# EAGLE design Microduino-Core BLE 20140627 (EAGLE 6.3)
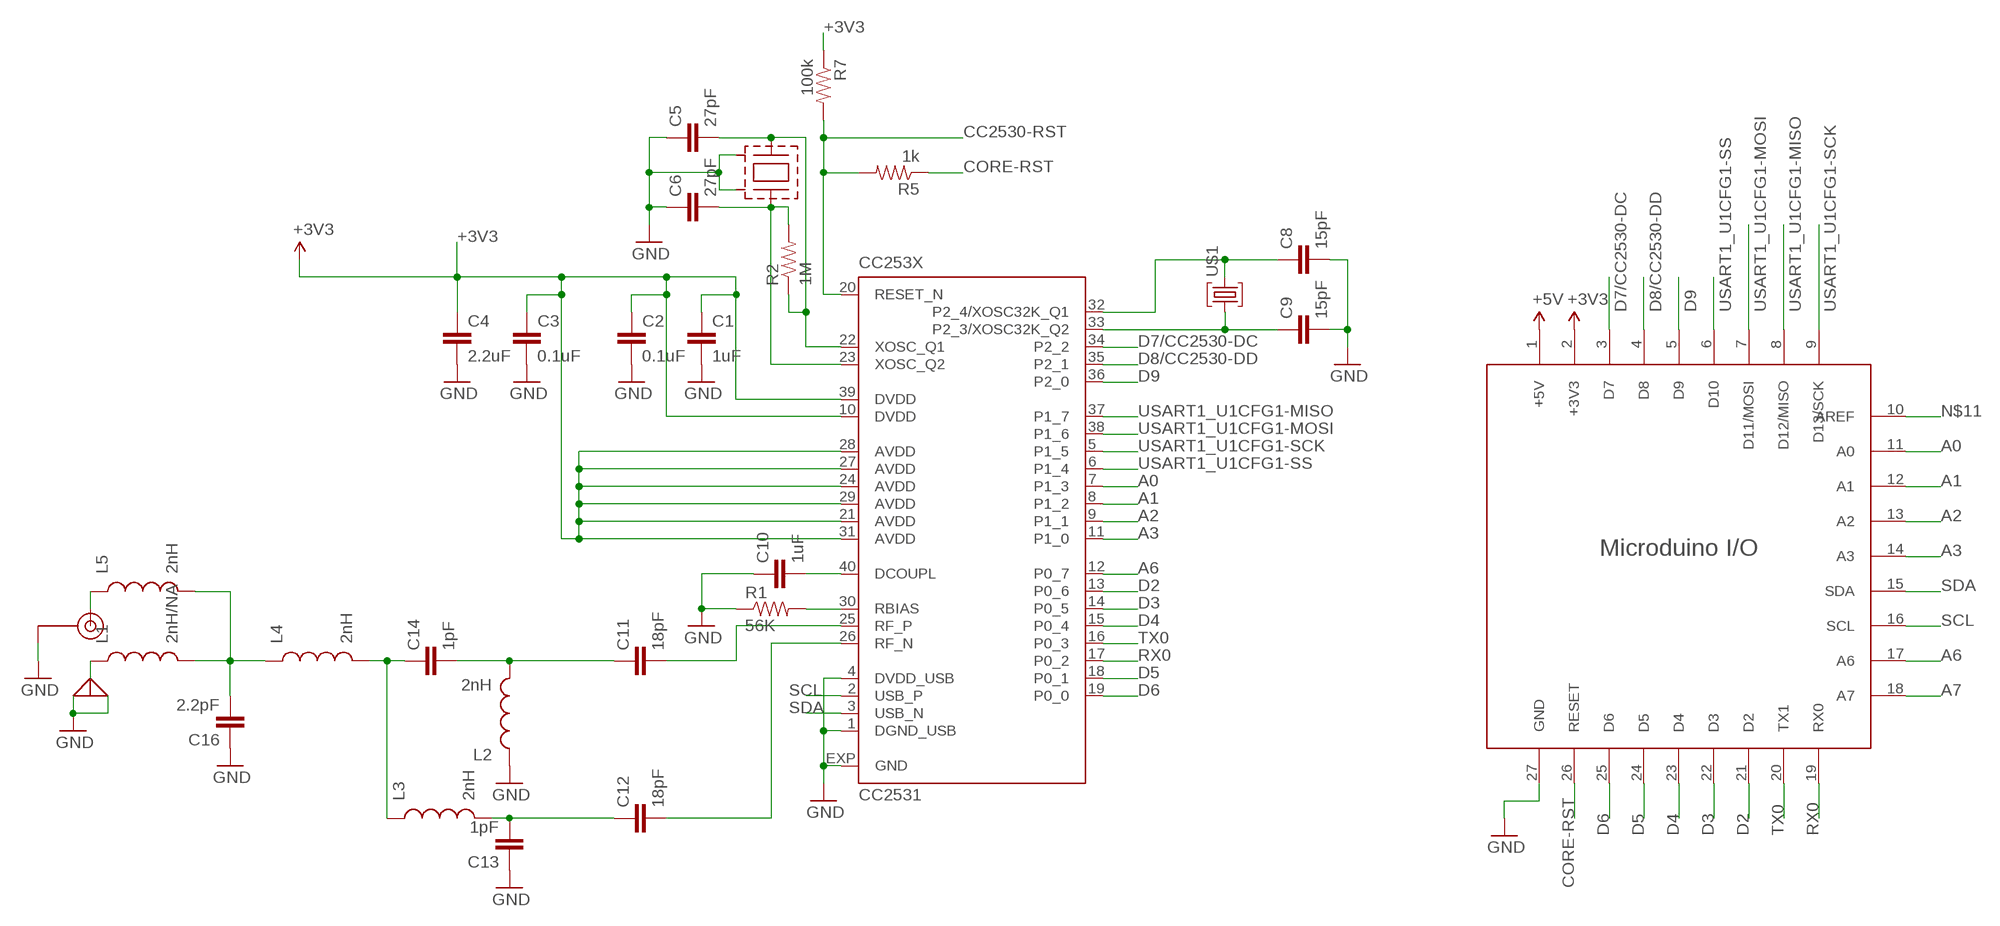
[diagram p0: schematic, sheet 1]

## Parts
C1  1uF  CAP0603-CAP  [0603-CAP]
C2  0.1uF  CAP0402-CAP  [0402-CAP]
C3  0.1uF  CAP0402-CAP  [0402-CAP]
C4  2.2uF  CAP0402-CAP  [0402-CAP]
C5  27pF  CAP0402-CAP  [0402-CAP]
C6  27pF  CAP0402-CAP  [0402-CAP]
C8  15pF  CAP0402-CAP  [0402-CAP]
C9  15pF  CAP0402-CAP  [0402-CAP]
C10  1uF  CAP0603-CAP  [0603-CAP]
C11  18pF  CAP0402-CAP  [0402-CAP]
C12  18pF  CAP0402-CAP  [0402-CAP]
C13  1pF  CAP0402-CAP  [0402-CAP]
C14  1pF  CAP0402-CAP  [0402-CAP]
C16  2.2pF  CAP0402-CAP  [0402-CAP]
CC253X  CC2531  [RHA_S-PVQFN-N40]
CRYS.1  CRYSTAL-SMD  [CRYSTAL-SMD-3225]
L1  2nH/NA  INDUCTOR0402  [C0402]
L2  2nH  INDUCTOR0402  [C0402]
L3  2nH  INDUCTOR0402  [C0402]
L4  2nH  INDUCTOR0402  [C0402]
L5  2nH  INDUCTOR0402  [C0402]
R1  56K  RESISTOR0402-RES  [0402-RES]
R2  1M  RESISTOR0402-RES  [0402-RES]
R5  1k  RESISTOR0402-RES  [0402-RES]
R7  100k  RESISTOR0402-RES  [0402-RES]
U$1  32.768-3215  [3215-2PIN]
U$2  ANT2.4G  [ANT2.4G]
U$3  ANT-IPEX  [IPEX]
U$7  MICRDUINO-PIN/NORMAL  [27UPIN-NORMAL]

## Nets
+3V3: C1.1 C2.1 C3.1 C4.1 CC253X.10(DVDD) CC253X.21(AVDD) CC253X.24(AVDD) CC253X.27(AVDD) CC253X.28(AVDD) CC253X.29(AVDD) CC253X.31(AVDD) CC253X.39(DVDD) R7.1 U$7.2(+3V3)
+5V: U$7.1(+5V)
A0: CC253X.7(P1_3) U$7.11(A0)
A1: CC253X.8(P1_2) U$7.12(A1)
A2: CC253X.9(P1_1) U$7.13(A2)
A3: CC253X.11(P1_0) U$7.14(A3)
A6: CC253X.12(P0_7) U$7.17(A6)
A7: U$7.18(A7)
CC2530-RST: CC253X.20(RESET_N) R5.2 R7.2
CORE-RST: R5.1 U$7.26(RESET)
D2: CC253X.13(P0_6) U$7.21(D2)
D3: CC253X.14(P0_5) U$7.22(D3)
D4: CC253X.15(P0_4) U$7.23(D4)
D5: CC253X.18(P0_1) U$7.24(D5)
D6: CC253X.19(P0_0) U$7.25(D6)
D7/CC2530-DC: CC253X.34(P2_2) U$7.3(D7)
D8/CC2530-DD: CC253X.35(P2_1) U$7.4(D8)
D9: CC253X.36(P2_0) U$7.5(D9)
GND: C1.2 C2.2 C3.2 C4.2 C5.1 C6.1 C8.2 C9.2 C10.1 C13.1 C16.1 CC253X.1(DGND_USB) CC253X.4(DVDD_USB) CC253X.EXP(GND) CRYS.1.2 CRYS.1.4 L2.1 R1.1 U$2.GND(GND2) U$3.1(GND1) U$3.2(GND2) U$7.27(GND)
N$1: C16.2 L1.2 L4.1 L5.2
N$2: C10.2 CC253X.40(DCOUPL)
N$3: C5.2 CC253X.22(XOSC_Q1) CRYS.1.1 R2.1
N$4: C6.2 CC253X.23(XOSC_Q2) CRYS.1.3 R2.2
N$5: CC253X.30(RBIAS) R1.2
N$6: C11.2 CC253X.25(RF_P)
N$7: C12.2 CC253X.26(RF_N)
N$8: C11.1 C14.2 L2.2
N$9: C12.1 C13.2 L3.2
N$10: C14.1 L3.1 L4.2
N$11: U$7.10(AREF)
N$12: L1.1 U$3.3(ANT)
N$13: C8.1 CC253X.32(P2_4/XOSC32K_Q1) U$1.P$2
N$14: C9.1 CC253X.33(P2_3/XOSC32K_Q2) U$1.P$1
N$15: L5.1 U$2.ANT(IN)
RX0: CC253X.17(P0_2) U$7.19(RX0)
SCL: CC253X.2(USB_P) U$7.16(SCL)
SDA: CC253X.3(USB_N) U$7.15(SDA)
TX0: CC253X.16(P0_3) U$7.20(TX1)
USART1_U1CFG1-MISO: CC253X.37(P1_7) U$7.8(D12/MISO)
USART1_U1CFG1-MOSI: CC253X.38(P1_6) U$7.7(D11/MOSI)
USART1_U1CFG1-SCK: CC253X.5(P1_5) U$7.9(D13/SCK)
USART1_U1CFG1-SS: CC253X.6(P1_4) U$7.6(D10)

## Library data of the parts
C1-C6 C8-C14 C16 = #_microduino_20131030:CAP: Capacitor Standard 0603 ceramic capacitor, and 0.1" leaded capacitor.
CC253X = texas:CC2531: A USB Enabled System-On-Chip Solution for 2.4-GHz IEEE 802.15.4 and ZigBee Source: http://focus.ti.com/lit/ds/symlink/cc2531.pdf; MPN: CC2531F256RHAT; OC_FARNELL: 1776351; OC_NEWARK: 34R2713
CRYS.1 = MY3:CRYSTAL-SMD
L1-L5 = #_microduino_20131030:INDUCTOR: Inductors Basic Inductor/Choke - 0603 and 1206. Footprints are not proven and vary greatly between part numbers.
R1 R2 R5 R7 = #_microduino_20131030:RESISTOR: Resistor Basic schematic elements and footprints for 0603, 1206, and PTH 1/10th watt (small) resistors.
U$1 = #_PKJ:32.768-3215
U$2 = #_PKJ:ANT2.4G
U$3 = #_microduino_20131030:ANT-IPEX
U$7 = #_microduino_20131030:MICRDUINO-PIN: microduino引脚封装

## Net classes
0 default: width 0.254 mm, drill 0.61 mm, clearance 0.254 mm

## Board
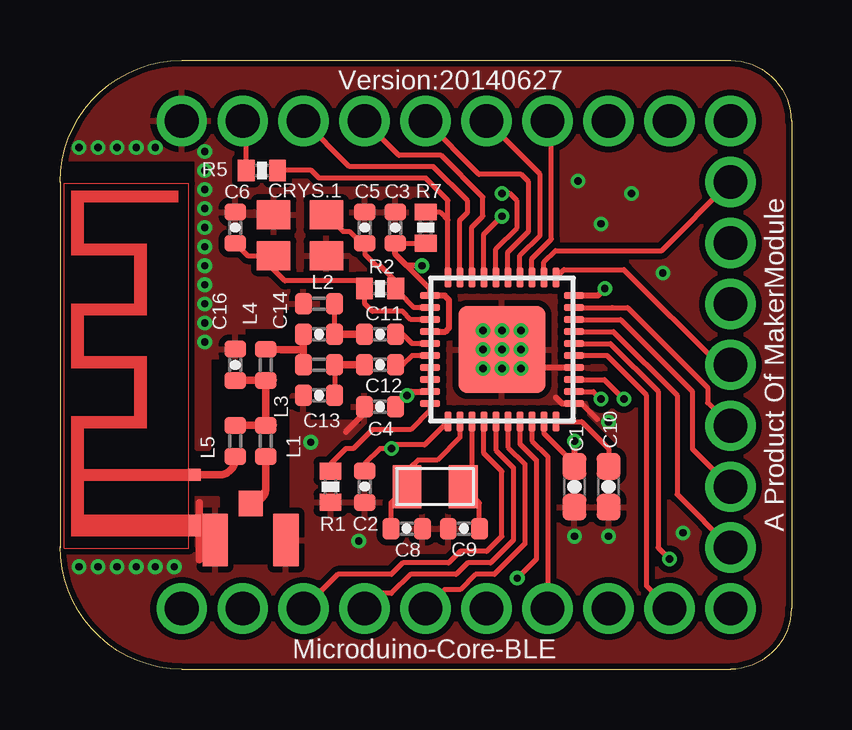
[diagram p1: board, top side]
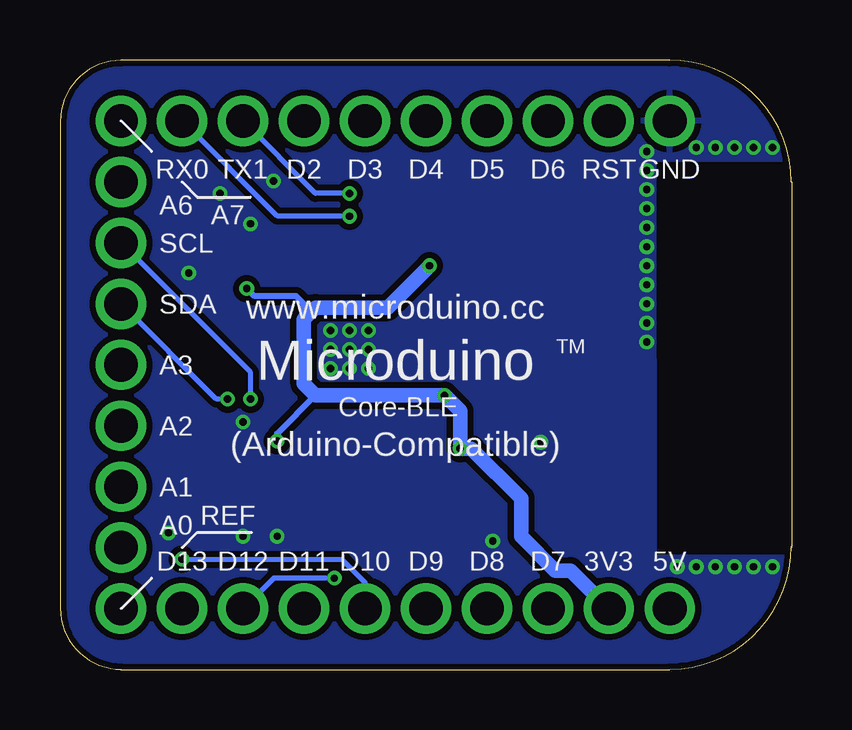
[diagram p2: board, bottom side, seen from below]

Size 30.48 x 25.4 mm. Coordinates in mm from the lower left corner, seen from the top.
Outline: 5.07,0.01 arc-90 0.01,5.14
Outline: 5.08,25.4 27.94,25.4
Outline: 27.94,0 5.08,0
Outline: 27.93,25.39 arc-90 30.47,22.85
Outline: 0.01,20.31 arc-90 5.08,25.39
Outline: 30.47,2.55 arc-90 27.93,0.01
Outline: 30.48,22.86 30.48,2.54
Outline: 0,20.32 0,5.08
Copper layers (1*16): Top 0.035mm / dielectric 1.5mm / Bottom 0.035mm
Design rules "Microduino": minimum track width 6mil, minimum drill 10mil, track to track 6mil, track to pad 6mil, pad to pad 6mil, via to via 6mil, smd to smd 6mil, copper to edge 6mil, drill to drill 6mil, minimum pad ring 6mil, minimum via ring 6mil, stop-mask expansion 4mil, vias tented up to drill 18mil, thermal gap 10mil

### Footprints (pad centres in the part's own frame; a part is rotated, then mirrored left to right if it is on the bottom)
0603-CAP = smd 1.1 x 1: 1 -0.85,0; 2 0.85,0
0402-CAP = smd 0.7 x 0.9: 1 -0.65,0; 2 0.65,0
RHA_S-PVQFN-N40 = smd 0.85 x 0.3: 1 -3,2.25; 2 -3,1.75; 3 -3,1.25; 4 -3,0.75; 5 -3,0.25; 6 -3,-0.25; 7 -3,-0.75; 8 -3,-1.25; 9 -3,-1.75; 10 -3,-2.25; 21 3,-2.25; 22 3,-1.75; 23 3,-1.25; 24 3,-0.75; 25 3,-0.25; 26 3,0.25; 27 3,0.75; 28 3,1.25; 29 3,1.75; 30 3,2.25 | smd 0.3 x 0.85: 11 -2.25,-3; 12 -1.75,-3; 13 -1.25,-3; 14 -0.75,-3; 15 -0.25,-3; 16 0.25,-3; 17 0.75,-3; 18 1.25,-3; 19 1.75,-3; 20 2.25,-3; 31 2.25,3; 32 1.75,3; 33 1.25,3; 34 0.75,3; 35 0.25,3; 36 -0.25,3; 37 -0.75,3; 38 -1.25,3; 39 -1.75,3; 40 -2.25,3 | smd 3.611 x 3.611: EXP 0,0
CRYSTAL-SMD-3225 = smd 1.4 x 1.2: 1 -1.1,-0.85; 2 1.1,-0.85; 3 1.1,0.85; 4 -1.1,0.85
C0402 = smd 0.7 x 0.9: 1 -0.65,0; 2 0.65,0
0402-RES = smd 0.7 x 0.9: 1 -0.65,0; 2 0.65,0
3215-2PIN = smd 1.2 x 1.8: P$1 -2.35,0; P$2 0,0
ANT2.4G = smd 0.5 x 0.5: ANT 2.554,0.251 | smd 0.9 x 0.5: GND 0.452,0.251
IPEX = smd 1.05 x 2.2: 1 -1.475,0; 2 1.475,0 | smd 1 x 1.05: 3 0,1.525
27UPIN-NORMAL = drill 1.4: 1 0,-10.16; 2 2.54,-10.16; 3 5.08,-10.16; 4 7.62,-10.16; 5 10.16,-10.16; 6 12.7,-10.16; 7 15.24,-10.16; 8 17.78,-10.16; 9 20.32,-10.16; 10 22.86,-10.16; 11 22.86,-7.62; 12 22.86,-5.08; 13 22.86,-2.54; 14 22.86,0; 15 22.86,2.54; 16 22.86,5.08; 17 22.86,7.62; 18 22.86,10.16; 19 20.32,10.16; 20 17.78,10.16; 21 15.24,10.16; 22 12.7,10.16; 23 10.16,10.16; 24 7.62,10.16; 25 5.08,10.16; 26 2.54,10.16; 27 0,10.16

### Placement (x,y rotation side)
C1  21.43,7.62 270 top
C2  12.7,7.62 270 top
C3  13.97,18.41 90 top
C4  13.33,10.95 180 top
C5  12.7,18.41 270 top
C6  7.3,18.41 270 top
C8  14.45,5.87 0 top
C9  16.83,5.87 180 top
C10  22.86,7.62 90 top
C11  13.33,13.97 0 top
C12  13.33,12.7 0 top
C13  10.79,11.43 0 top
C14  10.79,13.97 0 top
C16  7.3,12.7 270 top
CC253X  18.41,13.34 180 top
CRYS.1  10,18.1 180 top
L1  8.57,9.53 90 top
L2  10.79,15.24 0 top
L3  10.79,12.7 0 top
L4  8.57,12.7 90 top
L5  7.3,9.53 90 top
R1  11.27,7.62 90 top
R2  13.34,15.88 180 top
R5  8.41,20.8 0 top
R7  15.24,18.42 90 top
U$1  14.46,7.62 180 top
U$2  5.87,5.56 90 top
U$3  7.94,5.4 0 top
U$7  5.07,12.7 0 top

### Tracks (layer width: path | path; a pad name or v marks a point on that pad's centre or on a via)
+3V3  (via drill 0.3)
  Top 0.203: CC253X.39 20.16,9.84 21.43,8.57 C1.1 | CC253X.21 15.41,15.86 14.45,16.83 | C3.1 R7.1 | CC253X.31 15.2,9.37 13.97,9.37 v13.81,9.21 13.34,9.21 12.7,8.57 C2.1 | CC253X.27 CC253X.28 CC253X.29
  Top 0.254: C3.1 13.97,17.3 14.45,16.83 v15.08,16.83 | v22.7,15.88 22.41,15.59 CC253X.10 | v21.43,9.53 21.43,9.37 C1.1 | CC253X.29 14.62,11.59 14.61,11.58 v14.46,11.43 C4.1 | CC253X.24 16.06,14.09 16.21,14.23 16.21,15.4 16.03,15.59 CC253X.21
  Bottom 0.254: 20.32,14.61 20.32,15.24 20.64,15.56 22.38,15.56 v22.7,15.88 | 21.43,9.84 v21.43,9.53 21.43,9.84 19.84,11.43
  Bottom 0.61: v15.08,16.83 16.83,15.08 19.84,15.08 20.32,14.61 20.32,11.91 19.84,11.43 v14.46,11.43 13.81,10.78 v13.81,9.21 13.34,9.21 11.27,7.14 11.27,5.56 9.84,4.13 9.21,4.13 U$7.2
A0
  Top 0.203: CC253X.7 23.06,14.09 25.72,11.43 25.72,7.3 U$7.11
A1
  Top 0.203: CC253X.8 23.36,14.59 26.35,11.59 26.35,9.2 U$7.12
A2
  Top 0.203: CC253X.9 23.01,15.09 23.01,15.08 23.65,15.08 26.99,11.75 26.99,11.11 U$7.13
A3
  Top 0.203: CC253X.11 21,16.67 23.5,16.67 27.46,12.7 U$7.14
A6
  Top 0.203: CC253X.12 20.16,16.99 20.64,17.46 25.08,17.46 U$7.17
CC2530-RST
  Top 0.203: CC253X.20 16.16,18.73 | 16.16,18.73 16.16,19.55 15.24,20.48 10.79,20.48 10.48,20.8 R5.2 | 16.16,18.73 15.85,19.05 15.26,19.05 R7.2
CORE-RST
  Top 0.203: R5.1 7.76,22.71 U$7.26
D2
  Top 0.203: CC253X.13 19.66,17.12 20.48,17.94 20.48,22.7 U$7.21
D3
  Top 0.203: CC253X.14 19.16,17.26 20,18.1 20,20.63 U$7.22
D4
  Top 0.203: CC253X.15 18.66,17.39 19.53,18.26 19.53,20.32 19.21,20.64 17.46,20.64 U$7.23
D5
  Top 0.203: U$7.24 14.12,21.43 15.88,21.43 17.62,19.68 17.62,18.89 17.16,18.43 CC253X.18
D6
  Top 0.203: U$7.25 12.06,20.95 15.56,20.95 16.99,19.53 16.99,19.05 16.66,18.73 CC253X.19
D7/CC2530-DC
  Top 0.203: CC253X.34 17.66,9.01 18.41,8.26 18.41,5.56 17.78,4.92 16.67,4.92 16.19,4.45 14.29,4.45 13.81,3.97 11.58,3.97 U$7.3
D8/CC2530-DD
  Top 0.203: CC253X.35 18.16,9.14 18.89,8.41 18.89,5.4 17.94,4.45 16.99,4.45 16.51,3.97 14.61,3.97 13.81,3.17 13.33,3.17 U$7.4
D9
  Top 0.203: CC253X.36 18.66,9.28 19.37,8.57 19.37,5.24 18.1,3.97 17.3,3.97 16.67,3.33 16.03,3.33 U$7.5
GND  (via drill 0.3)
  Top 0.203: CC253X.1 21.73,11.09 22.4,10.41
  Top 0.254: CC253X.4 19.16,12.59 CC253X.EXP | C4.2 12.69,10.68 11.91,9.9 | CC253X.1 20.92,11.09 20.67,11.33
  Top 0.305: U$3.1 6.46,6.01 U$2.GND | 5.79,6.96 5.79,4.58
  other vias: 21.43,5.56 22.86,5.56 22.86,10.32 18.41,13.34 17.62,13.34 17.62,12.54 17.62,14.13 18.41,14.13 19.21,14.13 19.21,13.34 19.21,12.54 18.41,12.54 6.03,20 6.03,19.21 6.03,18.41 6.03,17.62 6.03,16.83 6.03,16.03 6.03,15.24 6.03,14.45 6.03,13.65 0.79,4.29 1.59,4.29 2.38,4.29 3.17,4.29 3.97,4.29 4.76,4.29 0.79,21.75 1.59,21.75 2.38,21.75 3.17,21.75 3.97,21.75 6.03,21.59 6.03,20.8 25.12,16.53 22.54,18.57 23.81,19.84 12.45,5.36 10.45,9.47 21.58,20.36 25.96,5.7
  pour Bottom (isolate 0.254, rank 6): 0,25.4 30.48,25.4 30.48,0 0,0 -0.03,4.69 5.69,4.69 5.71,21.27 0,21.27
  pour Top (isolate 0.254, rank 6): 0,0 0,4.76 5.4,4.76 5.4,7.14 6.56,7.14 6.56,4.29 9.68,4.29 9.68,11.43 10.32,11.43 10.32,10.32 12.22,10.32 12.22,11.43 14.45,11.43 14.45,15.08 9.21,15.08 9.21,14.29 7.62,14.29 7.62,13.02 6.19,13.02 6.19,9.21 5.71,9.21 5.71,21.27 0,21.27 0,25.4 30.48,25.4 30.48,0
N$1
  Top 0.305: C16.2 8.89,12.05 L4.1 L1.2 8.89,10.18 L5.2
N$2
  Top 0.203: CC253X.40 21.73,10.34 22.86,9.21 C10.2
N$3
  Top 0.203: CC253X.22 14.76,15.09 14.13,15.72 R2.1 13.97,15.73 13.97,16.19 13.34,16.83 13.18,16.83 12.7,17.3 C5.2 12.56,17.77 12.06,18.26 11.79,18.26 CRYS.1.1
N$4
  Top 0.203: CC253X.23 14.62,14.59 14.29,14.92 13.02,14.92 12.7,15.24 12.7,15.54 R2.2 12.37,16.19 9.37,16.19 8.9,16.66 CRYS.1.3 7.82,17.25 C6.2
N$5
  Top 0.203: CC253X.30 15.41,10.81 14.61,10 13.02,10 12.22,9.21 11.91,9.21 11.27,8.57 R1.2
N$6
  Top 0.203: CC253X.25 14.67,13.59 14.29,13.97 C11.2
N$7
  Top 0.203: CC253X.26 14.67,13.09 14.29,12.7 C12.2
N$8
  Top 0.203: C14.2 L2.2 | C11.1
  Top 0.305: C11.1 C14.2
N$9
  Top 0.203: C12.1 | L3.2 | L3.2 C13.2
  Top 0.305: C12.1 L3.2
N$10
  Top 0.203: C14.1
  Top 0.305: C14.1 10.14,13.34 | 10.14,13.34 L3.1 | L4.2 9.22,13.34 10.14,13.34
N$12
  Top 0.305: L1.1 8.57,7.56 arc-90 U$3.3
N$13
  Top 0.203: C8.1 13.8,6.96 U$1.P$2 14.62,8.42 14.92,8.73 15.72,8.73 16.66,9.68 CC253X.32
N$14
  Top 0.203: C9.1 17.48,6.95 U$1.P$1 17.16,7.82 CC253X.33
N$15
  Top 0.305: L5.1 arc-90 6.7,8.11 U$2.ANT
RX0  (via drill 0.3)
  Top 0.203: CC253X.17 17.66,18.14 v18.41,18.89
  Bottom 0.203: v18.41,18.89 21.43,18.89 U$7.19
SCL  (via drill 0.3)
  Top 0.203: CC253X.2 22.23,11.59 v22.54,11.27
  Bottom 0.203: v22.54,11.27 22.54,12.39 U$7.16
SDA  (via drill 0.3)
  Top 0.203: CC253X.3 22.68,12.09 v23.5,11.27
  Bottom 0.203: v23.5,11.27 23.96,11.27 U$7.15
TX0  (via drill 0.3)
  Top 0.203: CC253X.16 18.16,17.53 19.05,18.41 19.05,19.53 18.73,19.84 v18.41,19.84
  Bottom 0.203: v18.41,19.84 19.84,19.84 U$7.20
USART1_U1CFG1-MISO  (via drill 0.3)
  Top 0.203: CC253X.37 19.16,9.41 19.84,8.73 19.84,4.6 v19.05,3.81
  Bottom 0.203: v19.05,3.81 21.58,3.81 U$7.8
USART1_U1CFG1-MOSI
  Top 0.203: CC253X.38 19.66,9.54 20.32,8.89 U$7.7
USART1_U1CFG1-SCK
  Top 0.203: U$7.9 24.45,3.49 24.45,11.43 22.79,13.09 CC253X.5
USART1_U1CFG1-SS  (via drill 0.3)
  Top 0.203: CC253X.6 22.93,13.59 24.92,11.59 24.92,5.08 v25.4,4.6
  Bottom 0.203: v25.4,4.6 18.73,4.6 17.77,3.65 U$7.6

### Text on the board
tPlace: Version:20140627 | Microduino-Core-BLE
bPlace: Core-BLE